# EAGLE design view-board (EAGLE 7.6.0)
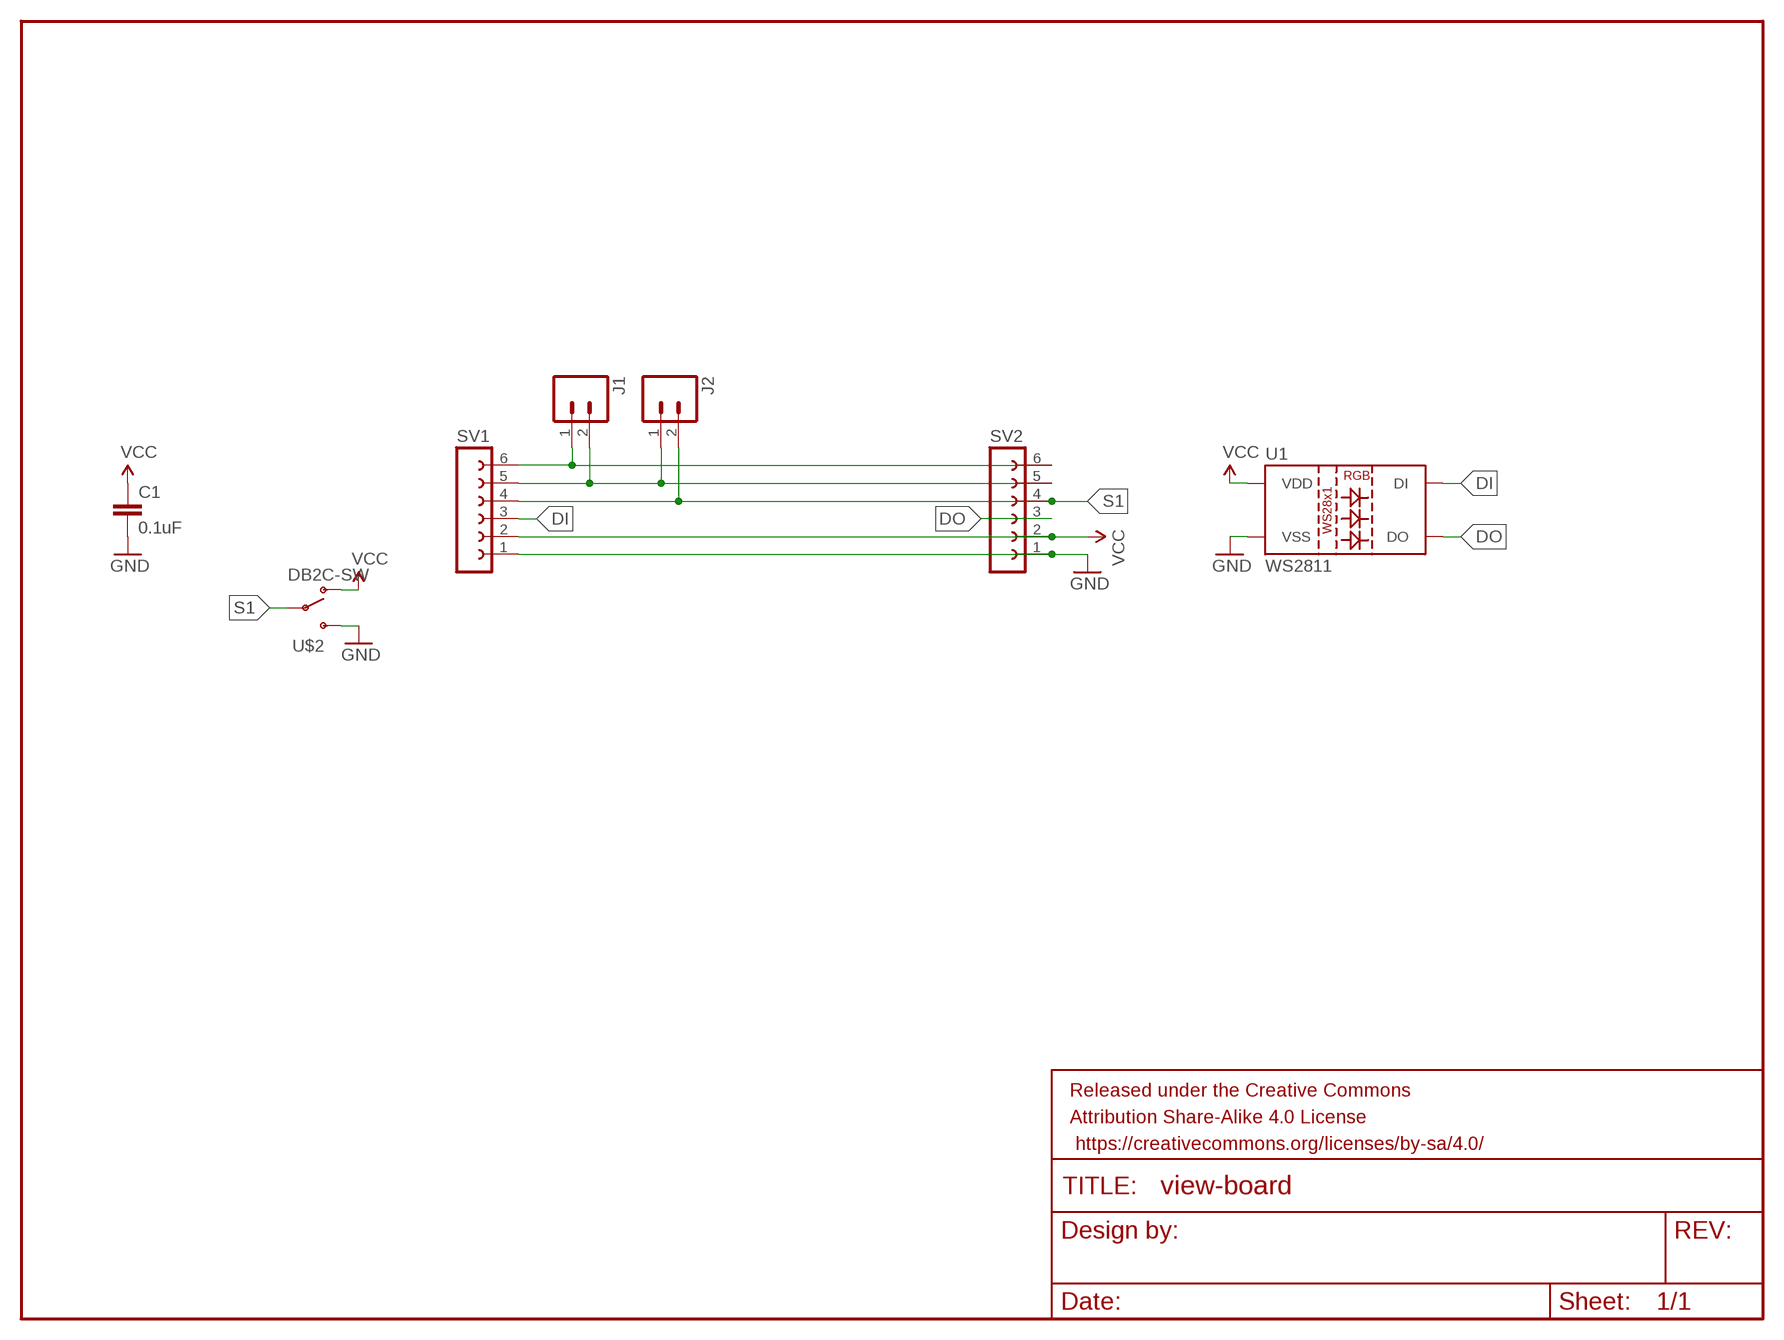
[diagram p0: schematic, sheet 1]

## Parts
C1  0.1uF  CAP0805  [0805]
FRAME1  FRAME-LETTER  [CREATIVE_COMMONS]
J1  M02LOCK  [1X02_LOCK]
J2  M02LOCK  [1X02_LOCK]
SV1  FE06-1  [FE06]
SV2  FE06-1  [FE06]
U1  WS2811  LED-TRICOLOR-5050-ICWS2811  [LED-TRICOLOR-5050-IC]
U$2  DB2C-SW  [CHERRY-DB2C]

## Nets
DI: SV1.3 U1.2(DI)
DO: SV2.3 U1.1(DO)
GND: C1.2 SV1.1 SV2.1 U1.6(VSS) U$2.3(S)
N$1: J1.1 SV1.6 SV2.6
N$2: J1.2 J2.1 SV1.5 SV2.5
S1: J2.2 SV1.4 SV2.4 U$2.2(P)
VCC: C1.1 SV1.2 SV2.2 U1.3(VDD) U1.5(VDD) U$2.1(O)

## Library data of the parts
C1 = SparkFun-Capacitors:CAP: Capacitor Standard 0603 ceramic capacitor, and 0.1" leaded capacitor.
FRAME1 = SparkFun-Aesthetics:FRAME-LETTER: Schematic Frame Standard 8.5x11 US Letter frame
J1 J2 = SparkFun-Connectors:M02: Standard 2-pin 0.1" header. Use with - straight break away headers ( PRT-00116) - right angle break away headers (PRT-00553) - swiss pins (PRT-00743) - machine pins (PRT-00117) - female headers (PRT-00115) Molex polarized connector foot print use with: PRT-08233 with associated crimp pins and housings. 2.54_SCREWTERM for use with PRT-10571. 3.5mm Screw Terminal footprints for PRT-08084 5mm Screw Terminal footprints for use with PRT-08432
SV1 SV2 = con-lsta:FE06-1: FEMALE HEADER; OC_FARNELL: unknown; OC_NEWARK: unknown
U1 = SparkFun-LED:LED-TRICOLOR-5050-IC: WS2812 RGB LED w/ WS2811 driver 5x5mm SMD LED with built-in controller IC. DIO-11598; PROD_ID: DIO-11598
U$2 = cherry-button:DB2C-SW: Cherry Snap-action Micro-switch DB2C Series

## Board
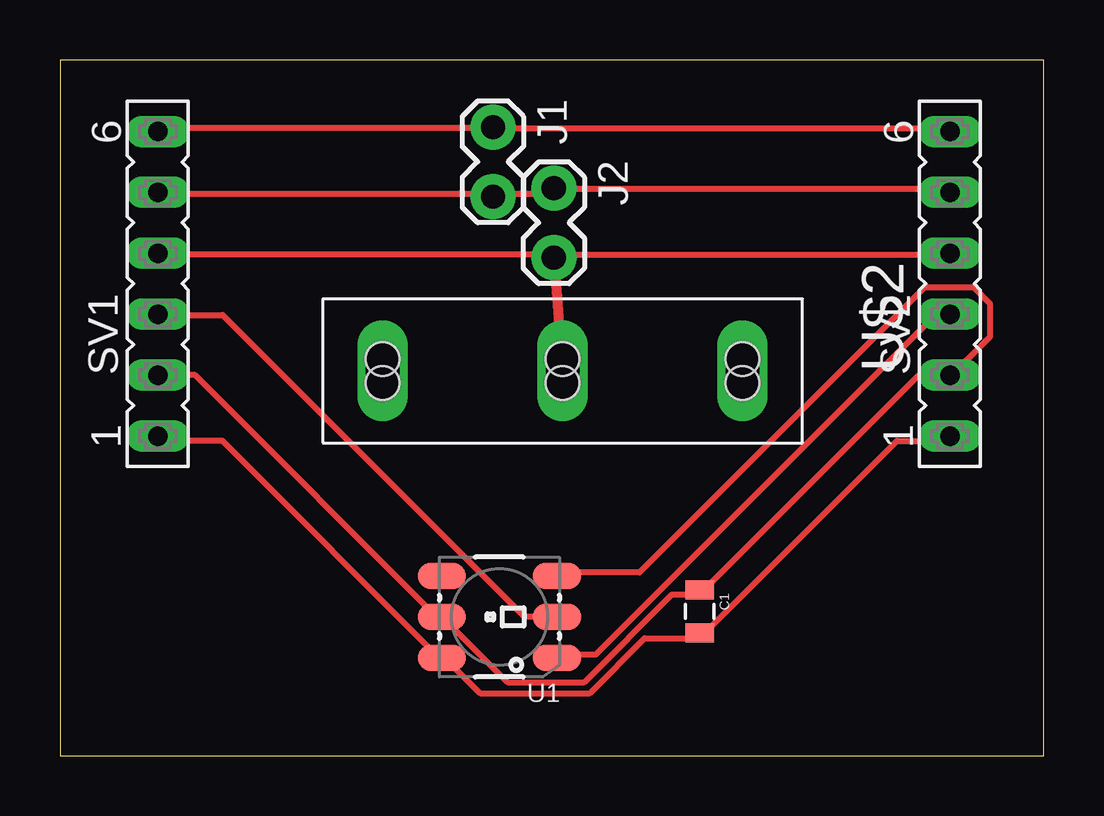
[diagram p1: board, top side]
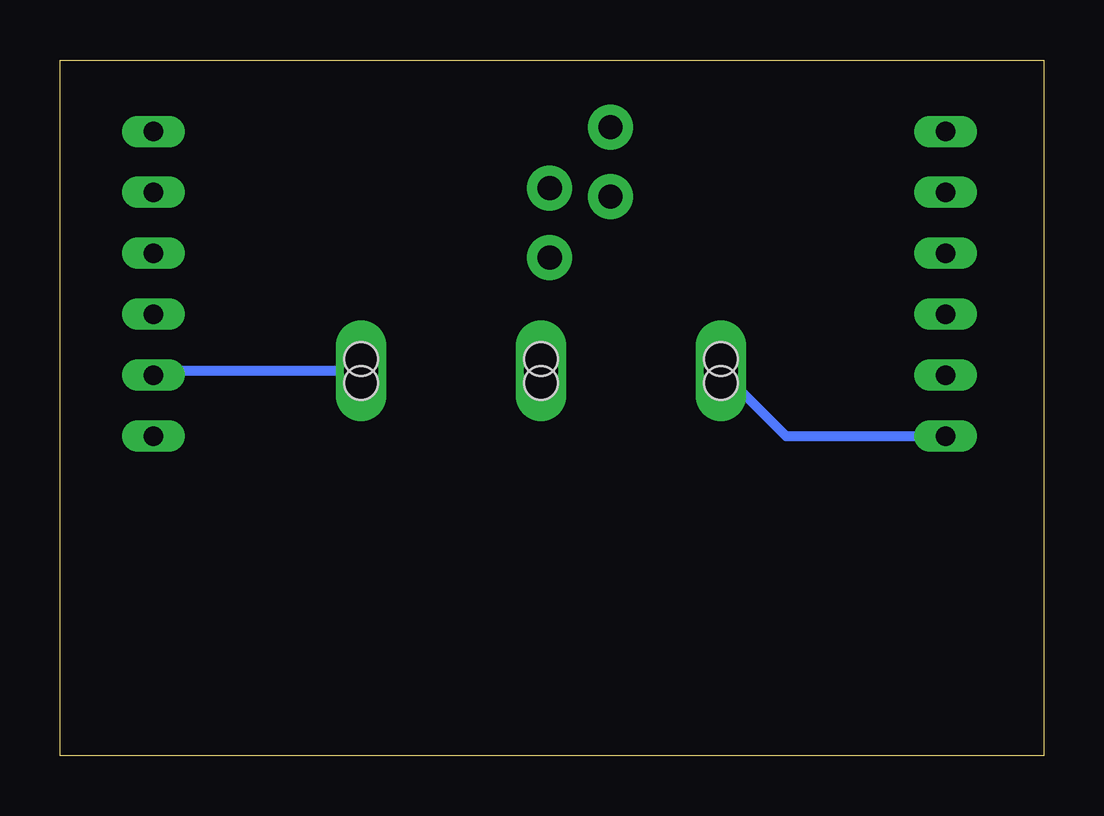
[diagram p2: board, bottom side, seen from below]

Size 41 x 29 mm. Coordinates in mm from the lower left corner, seen from the top.
Outline: 0,0 41,0 41,29 0,29 0,0
Copper layers (1*16): Top 0.035mm / dielectric 1.5mm / Bottom 0.035mm
Design rules "default": minimum track width 10mil, minimum drill 24mil, track to track 8mil, track to pad 8mil, pad to pad 8mil, via to via 8mil, smd to smd 8mil, copper to edge 40mil, drill to drill 8mil, minimum pad ring 10mil, minimum via ring 8mil, stop-mask expansion 4mil, vias tented up to drill 0mil, thermal gap 10mil

### Footprints (pad centres in the part's own frame; a part is rotated, then mirrored left to right if it is on the bottom)
0805 = smd 0.8 x 1.2: 1 -0.9,0; 2 0.9,0
1X02_LOCK = drill 1.016 pad 1.88: 1 -0.178,0; 2 2.718,0
FE06 = drill 0.813 long: 1 -6.35,0; 2 -3.81,0; 3 -1.27,0; 4 1.27,0; 5 3.81,0; 6 6.35,0
LED-TRICOLOR-5050-IC = smd 2 x 1.1: 1 -2.4,1.7; 2 -2.4,0; 3 -2.4,-1.7; 4 2.4,-1.7; 5 2.4,0; 6 2.4,1.7
CHERRY-DB2C = drill 1.4 long: 1 -7.45,-0.04; 2 0.05,-0.04; 3 7.55,-0.04 | hole 1.4: 0.05,0.46; 7.55,0.46; -7.45,-0.54; -7.45,0.46; 0.05,-0.54; 7.55,-0.54

### Placement (x,y rotation side)
C1  26.67,6.01 270 top
FRAME1  19.78,-14.62 0 top  (outside the outline)
J1  18.05,26.02 270 top
J2  20.59,23.48 270 top
SV1  4.08,19.67 90 top
SV2  37.1,19.67 90 top
U1  18.32,5.78 180 top
U$2  21,16 180 top

### Tracks (layer width: path | path; a pad name or v marks a point on that pad's centre or on a via)
DI
  Top 0.254: U1.2 20.72,5.8 19.34,5.8 6.77,18.38 4.26,18.38 SV1.3
DO
  Top 0.254: U1.1 20.95,4.2 22.32,4.2 36.49,18.38 36.95,18.38 SV2.3
GND
  Top 0.254: SV1.1 4.26,13.12 6.77,13.12 15.92,3.97 U1.6 16.14,3.97 17.52,2.6 22.09,2.6 24.38,4.89 26.66,4.89 C1.2 26.89,5.12 34.89,13.12 36.95,13.12 SV2.1
  Bottom 0.406: U$2.3 10.73,13.32 SV1.1
N$1
  Top 0.254: SV1.6 4.26,26.15 17.97,26.15 J1.1 18.2,26.15 36.95,26.15 SV2.6
N$2
  Top 0.254: SV1.5 4.26,23.4 17.97,23.4 J1.2 18.2,23.4 20.26,23.4 20.49,23.63 J2.1 20.72,23.63 36.95,23.63 SV2.5
S1
  Top 0.254: SV1.4 4.26,20.89 20.49,20.89 J2.2 20.72,20.89 36.95,20.89 SV2.4
  Top 0.406: J2.2 U$2.2
VCC
  Top 0.254: U1.3 20.95,7.63 24.15,7.63 36.03,19.52 38.09,19.52 38.78,18.83 38.78,17.46 37.18,15.86 SV2.2 35.8,15.86 26.89,6.95 C1.1 26.66,6.72 25.52,6.72 21.86,3.06 18.66,3.06 16.14,5.57 U1.5 15.92,5.57 5.63,15.86 SV1.2
  Bottom 0.406: U$2.1 37.1,16.04 SV2.2